# EAGLE schematic RZR_Ignition_Delay_Timer_v4 (EAGLE 9.7.0)
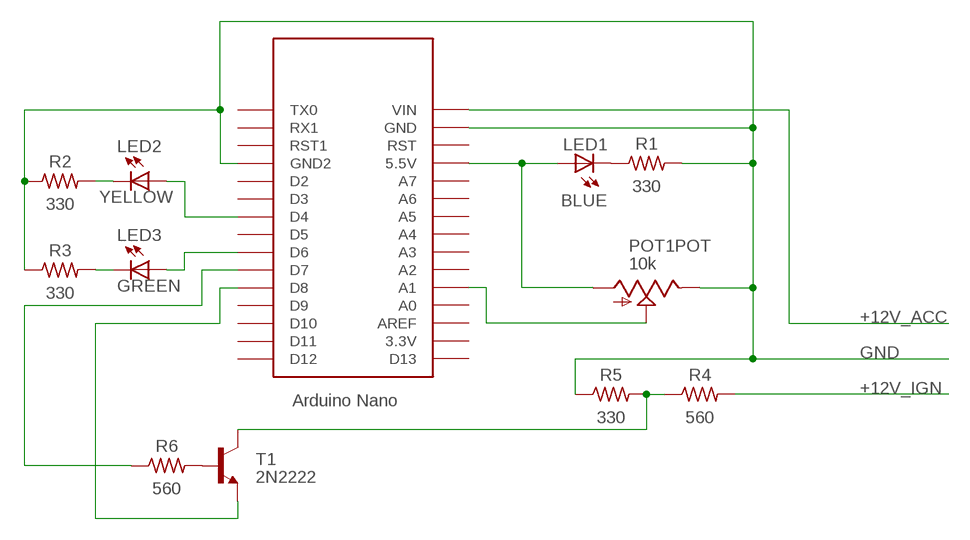
[diagram p0: schematic, sheet 1]

## Parts
LED1  BLUE  LEDSMLK34  [SMLK34]
LED2  YELLOW  LEDSMLK34  [SMLK34]
LED3  GREEN  LEDSMLK34  [SMLK34]
POT1  10k  THUMBPOTV  [THUMBWHEELV]
R1  330  R-US_AXIAL-7.2MM-PITCH  [RESAD724W46L381D178B]
R2  330  R-US_AXIAL-7.2MM-PITCH  [RESAD724W46L381D178B]
R3  330  R-US_AXIAL-7.2MM-PITCH  [RESAD724W46L381D178B]
R4  560  R-US_AXIAL-7.2MM-PITCH  [RESAD724W46L381D178B]
R5  330  R-US_AXIAL-7.2MM-PITCH  [RESAD724W46L381D178B]
R6  560  R-US_AXIAL-7.2MM-PITCH  [RESAD724W46L381D178B]
T1  2N2222  [TO92-EBC-OVAL]
U$1  NANO  [NANO]

## Nets
+12V_ACC: U$1.VIN
+12V_IGN: R4.2
GND: POT1.E(POT:E) R1.2 R2.1 R3.1 R5.1 U$1.GND U$1.GND1(GND2)
N$2: LED2.K(C) R2.2
N$3: LED1.K(C) R1.1
N$4: R6.2 T1.B
N$5: R6.1 U$1.D7
N$6: LED1.A POT1.A(POT:A) U$1.5V(5.5V)
N$7: T1.E U$1.D8
N$8: R4.1 R5.2 T1.C
N$9: LED3.K(C) R3.2
N$10: LED3.A U$1.D6
N$11: LED2.A U$1.D4
N$12: POT1.S(POT:S) U$1.A1
Unconnected: POT1.SW1(SW:S) POT1.SW2(SW:P) U$1.3.3V U$1.A0 U$1.A2 U$1.A3 U$1.A4 U$1.A5 U$1.A6 U$1.A7 U$1.AREF U$1.D2 U$1.D3 U$1.D5 U$1.D9 U$1.D10 U$1.D11 U$1.D12 U$1.D13 U$1.ICSP1 U$1.ICSP2 U$1.ICSP3 U$1.ICSP4 U$1.ICSP5 U$1.ICSP6 U$1.RST U$1.RST1 U$1.RX1 U$1.TX0

## Library data of the parts
LED1-LED3 = adafruit:LED: LED OSRAM: - CHIPLED LG R971, LG N971, LY N971, LG Q971, LY Q971, LO R971, LY R971 LH N974, LH R974 LS Q976, LO Q976, LY Q976 LO Q996 - Hyper CHIPLED LW Q18S LB Q993, LB Q99A, LB R99A - SideLED LS A670, LO A670, LY A670, LG A670, LP A670 LB A673, LV A673, LT A673, LW A673 LH A674 LY A675 LS A676, LA A676, LO A676, LY A676, LW A676 LS A679, LY A679, LG A679 - Hyper Micro SIDELED® LS Y876, LA Y876, LO Y876, LY Y876 LT Y87S - SmartLED LW L88C, LW L88S LB L89C, LB L89S, LG L890 LS L89K, LO L89K, LY L89K LS L896, LA L896, LO L896, LY L896 - TOPLED LS T670, LO T670, LY T670, LG T670, LP T670 LSG T670, LSP T670, LSY T670, LOP T670, LYG T670 LG T671, LOG T671, LSG T671 LB T673, LV T673, LT T673, LW T673 LH T674 LS T676, LA T676, LO T676, LY T676, LB T676, LH T676, LSB T676, LW T676 LB T67C, LV T67C, LT T67C, LS T67K, LO T67K, LY T67K, LW E67C LS E67B, LA E67B, LO E67B, LY E67B, LB E67C, LV E67C, LT E67C LW T67C LS T679, LY T679, LG T679 LS T770, LO T770, LY T770, LG T770, LP T770 LB T773, LV T773, LT T773, LW T773 LH T774 LS E675, LA E675, LY E675, LS T675 LS T776, LA T776, LO T776, LY T776, LB T776 LHGB T686 LT T68C, LB T68C - Hyper Mini TOPLED® LB M676 - Mini TOPLED Santana® LG M470 LS M47K, LO M47K, LY M47K Source: http://www.osram.convergy.de/
POT1 = adafruit:THUMBPOT: Thumbwheel pot with switch Available in horizontal (Alpha RV121SF) or vertical (Xicon 311-1701)
R1-R6 = Resistor:R-US: Resistor Fixed - ANSI; CATEGORY: Resistor; SUB-CATEGORY: Fixed
T1 = adafruit:2N2222: NPN TRANSISTOR Big oval pads
U$1 = Arduino-clone:NANO: Arduino Nano